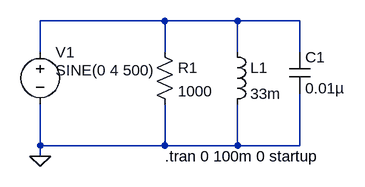
[diagram p0: schematic parallel_RLC.asc]
parallel_RLC.asc, the LTspice schematic file:
Version 4
SHEET 1 880 680
WIRE 208 96 16 96
WIRE 320 96 208 96
WIRE 416 96 320 96
WIRE 16 144 16 96
WIRE 208 144 208 96
WIRE 320 144 320 96
WIRE 416 144 416 96
WIRE 16 288 16 224
WIRE 208 288 208 224
WIRE 208 288 16 288
WIRE 320 288 320 224
WIRE 320 288 208 288
WIRE 416 288 416 208
WIRE 416 288 320 288
WIRE 16 304 16 288
FLAG 16 304 0
SYMBOL voltage 16 128 R0
WINDOW 123 24 124 Left 2
WINDOW 39 0 0 Left 0
WINDOW 3 24 44 Left 2
SYMATTR InstName V1
SYMATTR Value SINE(0 4 500)
SYMBOL res 192 128 R0
SYMATTR InstName R1
SYMATTR Value 1000
SYMBOL ind 304 128 R0
SYMATTR InstName L1
SYMATTR Value 33m
SYMBOL cap 400 144 R0
SYMATTR InstName C1
SYMATTR Value 0.01µ
TEXT 208 304 Left 2 !.tran 0 100m 0 startup

The netlist it stands for:
* parallel_RLC.asc
V1 N001 0 SINE(0 4 500)
R1 N001 0 1000
L1 N001 0 33m
C1 N001 0 0.01µ
.tran 0 100m 0 startup
.backanno
.end